# EAGLE design kultpfunzel (EAGLE 6.5.0)
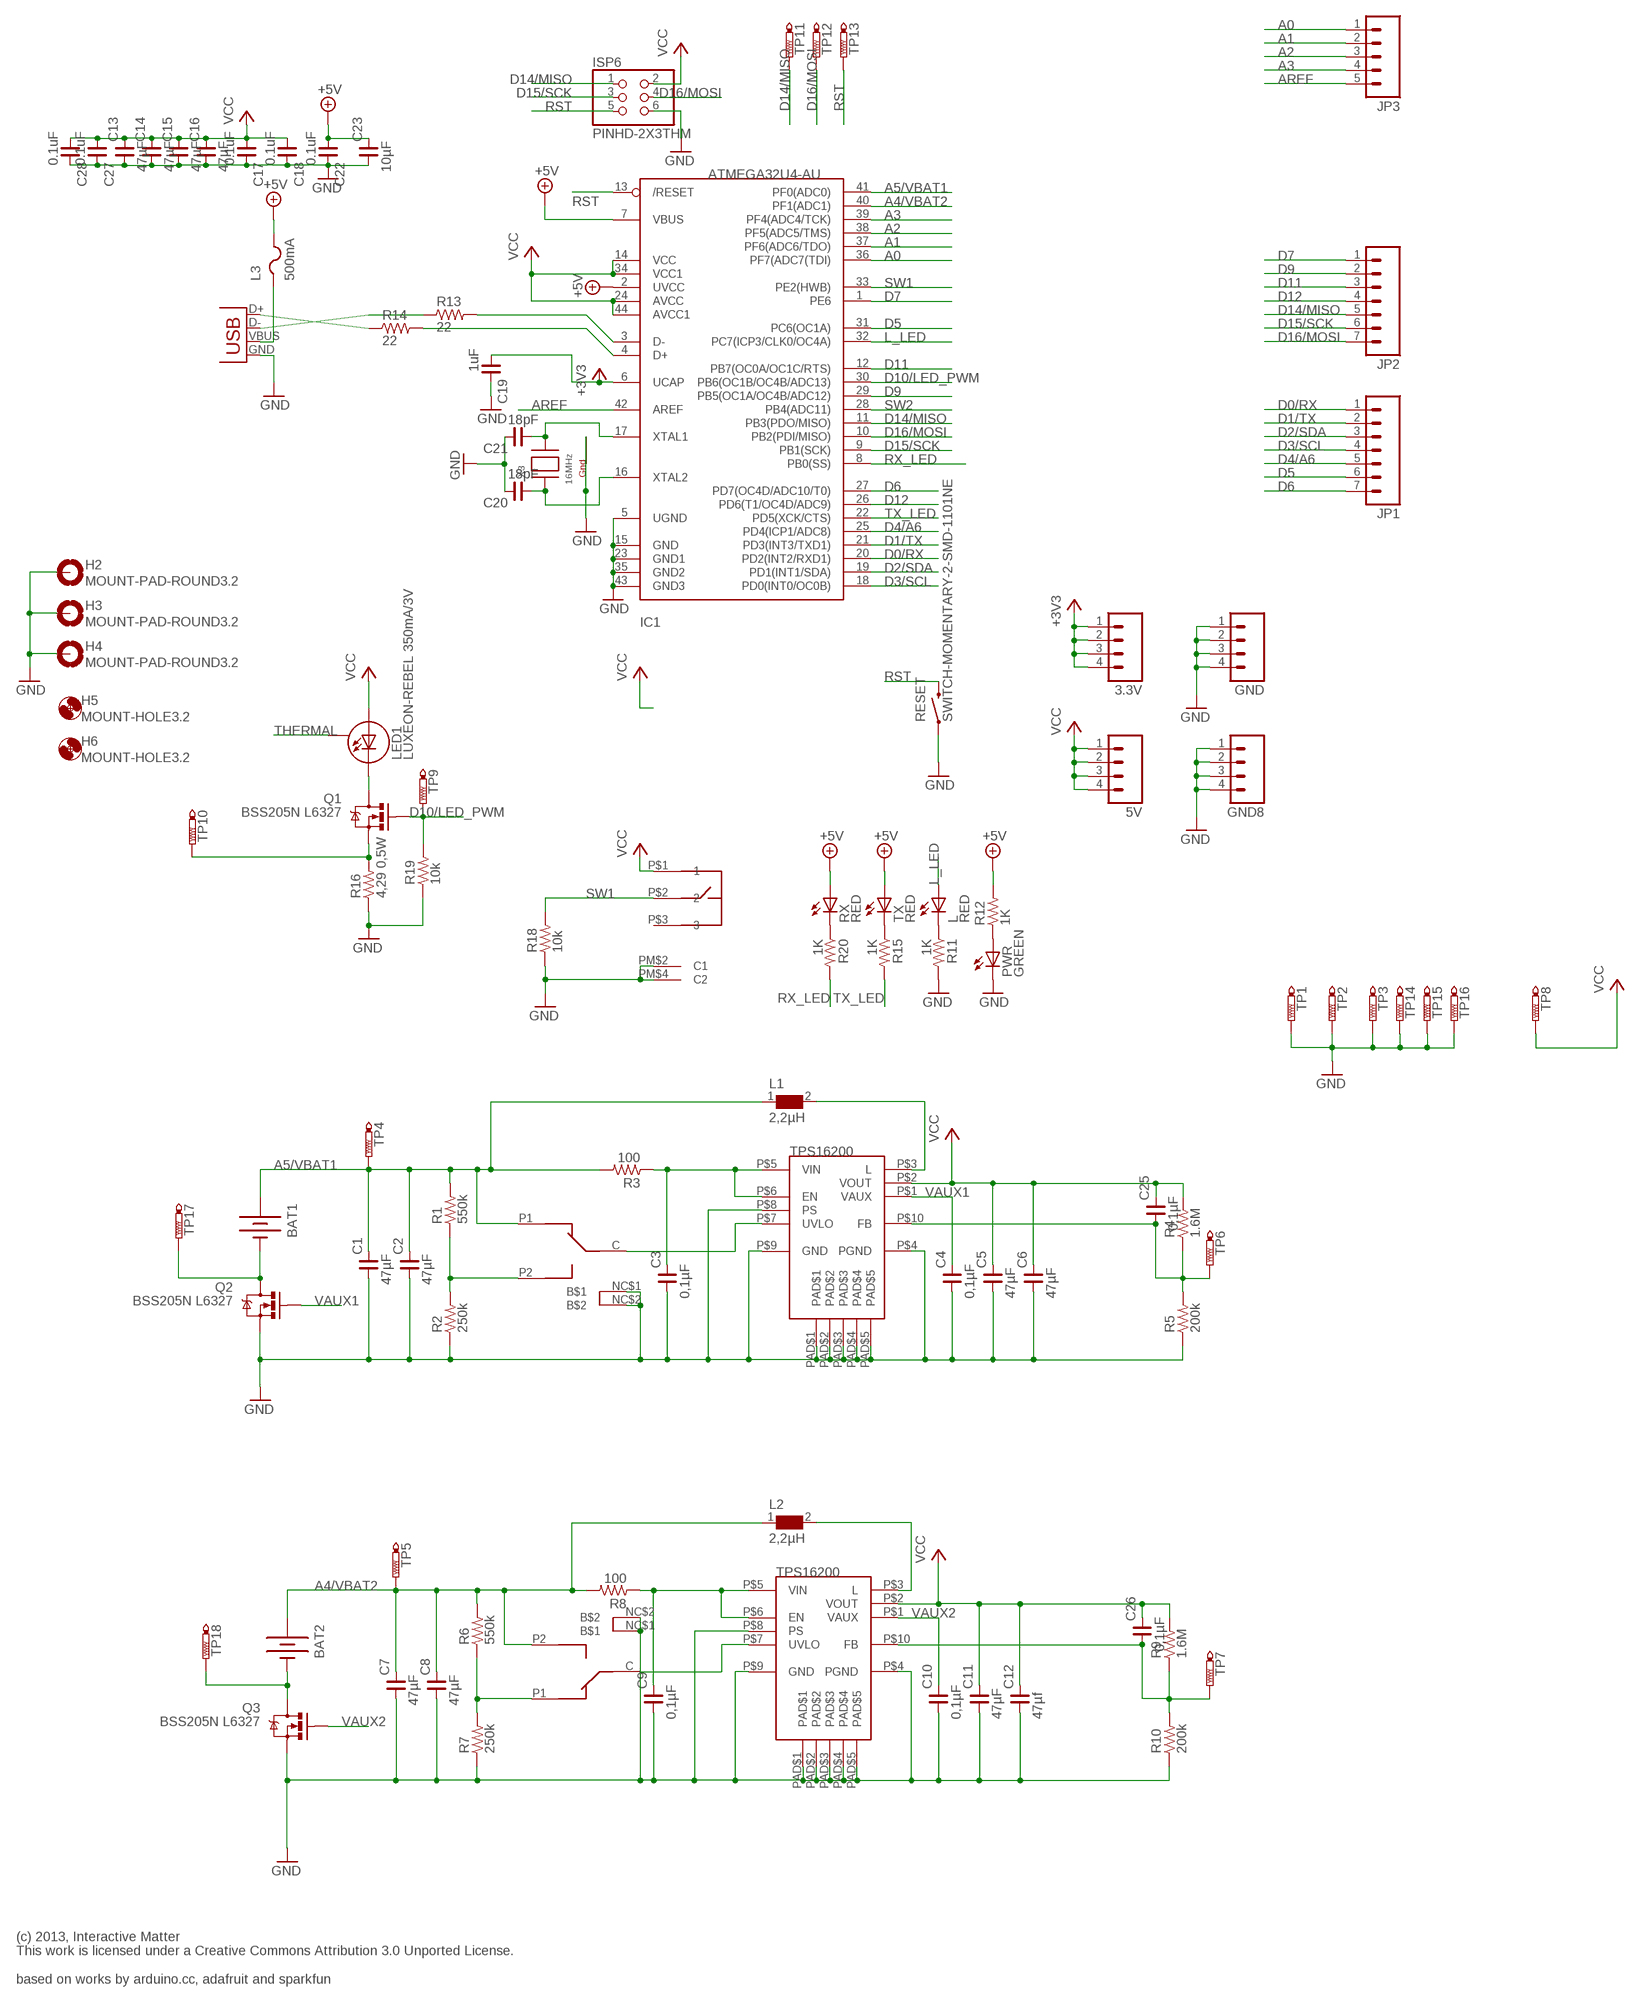
[diagram p0: schematic, sheet 1]

## Parts
3.3V  M04PTH  [1X04]
5V  M04PTH  [1X04]
BAT1  BATTERYAA  [BATTERY-AA]
BAT2  BATTERYAA  [BATTERY-AA]
C1  47µF  C_1206  [C1206]
C2  47µF  C_1206  [C1206]
C3  0,1µF  C_0402  [C0402]
C4  0,1µF  C_0402  [C0402]
C5  47µF  C_0805  [C0805]
C6  47µF  C_0805  [C0805]
C7  47µF  C_1206  [C1206]
C8  47µF  C_1206  [C1206]
C9  0,1µF  C_0402  [C0402]
C10  0,1µF  C_0402  [C0402]
C11  47µF  C_0805  [C0805]
C12  47µf  C_0805  [C0805]
C13  47µF  C_1206  [C1206]
C14  47µF  C_1206  [C1206]
C15  47µF  C_1206  [C1206]
C16  47µF  C_1206  [C1206]
C17  0.1uF  C_0402  [C0402]
C18  0.1uF  C_0402  [C0402]
C19  1uF  C_0603  [C0603]
C20  18pF  C_0402  [C0402]
C21  18pF  C_0402  [C0402]
C22  0.1uF  C_0603  [C0603]
C23  10µF  C_1206  [C1206]
C25  0,1µF  C_0603  [C0603]
C26  0,1µF  C_0603  [C0603]
C27  0.1uF  C_0402  [C0402]
C28  0.1uF  C_0402  [C0402]
GND  M04PTH  [1X04]
GND8  M04PTH  [1X04]
H2  MOUNT-PAD-ROUND3.2  [3,2-PAD]
H3  MOUNT-PAD-ROUND3.2  [3,2-PAD]
H4  MOUNT-PAD-ROUND3.2  [3,2-PAD]
H5  MOUNT-HOLE3.2  [3,2]
H6  MOUNT-HOLE3.2  [3,2]
IC1  ATMEGA32U4-AU  [TQFP44]
IC2  TPS61200DRCT  TPS16200  [10SON]
IC3  TPS61200DRCT  TPS16200  [10SON]
ISP6  PINHD-2X3THM  [ISP6]
JP1  M07  [1X07]
JP2  M07  [1X07]
JP3  M05PTH  [1X05]
L  RED  LEDCHIPLED_0603  [CHIPLED_0603]
L1  2,2µH  WE-PD2_M/MS  [WE-PD2_M/MS]
L2  2,2µH  WE-PD2_M/MS  [WE-PD2_M/MS]
L3  500mA  PTCFUSE-1206  [R1206]
LED1  LUXEON-REBEL 350mA/3V  LUXEON-REBEL  [LUXEON-REBEL]
PWR  GREEN  LEDCHIPLED_0603  [CHIPLED_0603]
Q1  BSS205N L6327  MOSFET-NCHANNELSMD  [SOT23-3]
Q2  BSS205N L6327  MOSFET-NCHANNELSMD  [SOT23-3]
Q3  BSS205N L6327  MOSFET-NCHANNELSMD  [SOT23-3]
R1  550k  R_0603  [R0603]
R2  250k  R_0603  [R0603]
R3  100  R_0603  [R0603]
R4  1.6M  R_0603  [R0603]
R5  200k  R_0603  [R0603]
R6  550k  R_0603  [R0603]
R7  250k  R_0603  [R0603]
R8  100  R_0603  [R0603]
R9  1.6M  R_0603  [R0603]
R10  200k  R_0603  [R0603]
R11  1K  R_0603  [R0603]
R12  1K  R_0603  [R0603]
R13  22  R_0603  [R0603]
R14  22  R_0603  [R0603]
R15  1K  R_0603  [R0603]
R16  4,29 0,5W  R_1210  [R1210]
R18  10k  R_0603  [R0603]
R19  10k  R_0603  [R0603]
R20  1K  R_0603  [R0603]
RESET  SWITCH-MOMENTARY-2-SMD-1101NE  [TACTILE-SWITCH-1101NE]
RX  RED  LEDCHIPLED_0603  [CHIPLED_0603]
SW  TL4105AF  [TL4105AF]
SW1  SMDSWITCHAYZ0102  [SMDSWITCH]
SW2  SMDSWITCHAYZ0102  [SMDSWITCH]
TP1  PTR1B1,27  [B1,27]
TP2  PTR1B1,27  [B1,27]
TP3  PTR1B1,27  [B1,27]
TP4  PTR1B1,27  [B1,27]
TP5  PTR1B1,27  [B1,27]
TP6  PTR1B1,27  [B1,27]
TP7  PTR1B1,27  [B1,27]
TP8  PTR1B1,27  [B1,27]
TP9  PTR1B1,27  [B1,27]
TP10  PTR1B1,27  [B1,27]
TP11  PTR1B1,27  [B1,27]
TP12  PTR1B1,27  [B1,27]
TP13  PTR1B1,27  [B1,27]
TP14  PTR1B1,27  [B1,27]
TP15  PTR1B1,27  [B1,27]
TP16  PTR1B1,27  [B1,27]
TP17  PTR1B1,27  [B1,27]
TP18  PTR1B1,27  [B1,27]
TX  RED  LEDCHIPLED_0603  [CHIPLED_0603]
USB  USB  USBMINIB-VERT  [USB-MINIB-VERT]
X3  16MHz  XTAL-4-3225  [NX3225]

## Nets
+3V3: 3.3V.1 3.3V.2 3.3V.3 3.3V.4 C19.1 IC1.6(UCAP)
+5V: C22.1 C23.2 IC1.2(UVCC) IC1.7(VBUS) L3.2 R12.2 RX.A TX.A
A0: IC1.36(PF7(ADC7(TDI)) JP3.1
A1: IC1.37(PF6(ADC6/TDO)) JP3.2
A2: IC1.38(PF5(ADC5/TMS)) JP3.3
A3: IC1.39(PF4(ADC4/TCK)) JP3.4
A4/VBAT2: BAT2.PWR@1(+) C7.2 C8.2 IC1.40(PF1(ADC1)) L2.1 R6.2 R8.2 SW1.P2 TP5.TP
A5/VBAT1: BAT1.PWR@1(+) C1.2 C2.2 IC1.41(PF0(ADC0)) L1.1 R1.2 R3.2 SW2.P1 TP4.TP
AREF: IC1.42(AREF) JP3.5
D0/RX: IC1.20(PD2(INT2/RXD1)) JP1.1
D1/TX: IC1.21(PD3(INT3/TXD1)) JP1.2
D2/SDA: IC1.19(PD1(INT1/SDA)) JP1.3
D3/SCL: IC1.18(PD0(INT0/OC0B)) JP1.4
D4/A6: IC1.25(PD4(ICP1/ADC8)) JP1.5
D5: IC1.31(PC6(OC1A)) JP1.6
D6: IC1.27(PD7(OC4D/ADC10/T0)) JP1.7
D7: IC1.1(PE6) JP2.1
D9: IC1.29(PB5(OC1A/OC4B/ADC12)) JP2.2
D10/LED_PWM: IC1.30(PB6(OC1B/OC4B/ADC13)) Q1.1(G) R19.2 TP9.TP
D11: IC1.12(PB7(OC0A/OC1C/RTS)) JP2.3
D12: IC1.26(PD6(T1/OC4D/ADC9)) JP2.4
D14/MISO: IC1.11(PB3(PDO/MISO)) ISP6.1 JP2.5 TP11.TP
D15/SCK: IC1.9(PB1(SCK)) ISP6.3 JP2.6
D16/MOSI: IC1.10(PB2(PDI/MISO)) ISP6.4 JP2.7 TP12.TP
GND: C1.1 C2.1 C3.1 C4.1 C5.1 C6.1 C7.1 C8.1 C9.1 C10.1 C11.1 C12.1 C13.1 C14.1 C15.1 C16.1 C17.2 C18.2 C19.2 C20.2 C21.2 C22.2 C23.1 C27.2 C28.2 GND8.1 GND8.2 GND8.3 GND8.4 GND.1 GND.2 GND.3 GND.4 H2.B3,2(MOUNT) H3.B3,2(MOUNT) H4.B3,2(MOUNT) IC1.5(UGND) IC1.15(GND) IC1.23(GND1) IC1.35(GND2) IC1.43(GND3) IC2.P$4(PGND) IC2.P$8(PS) IC2.P$9(GND) IC2.PAD$1 IC2.PAD$2 IC2.PAD$3 IC2.PAD$4 IC2.PAD$5 IC3.P$4(PGND) IC3.P$8(PS) IC3.P$9(GND) IC3.PAD$1 IC3.PAD$2 IC3.PAD$3 IC3.PAD$4 IC3.PAD$5 ISP6.6 PWR.C Q2.2(S) Q3.2(S) R2.1 R5.1 R7.1 R10.1 R11.2 R16.1 R18.1 R19.1 RESET.P$1 SW1.NC$1(B$1) SW1.NC$2(B$2) SW2.NC$1(B$1) SW2.NC$2(B$2) SW.PM$2(C1) SW.PM$4(C2) TP1.TP TP2.TP TP3.TP TP14.TP TP15.TP TP16.TP USB.GND X3.2(G2) X3.4(G1)
L_LED: IC1.32(PC7(ICP3/CLK0/OC4A)) L.A
N$1: PWR.A R12.1
N$2: R14.1 USB.D+
N$3: IC1.3(D-) R13.2
N$4: IC1.4(D+) R14.2
N$5: R13.1 USB.D-
N$6: LED1.CATHODE(C) Q1.3(D)
N$7: IC2.P$3(L) L1.2
N$8: C21.1 IC1.17(XTAL1) X3.3(X2)
N$9: C20.1 IC1.16(XTAL2) X3.1(X1)
N$10: L.C R11.1
N$11: R1.1 R2.2 SW2.P2
N$12: IC2.P$7(UVLO) SW2.C
N$13: Q1.2(S) R16.2 TP10.TP
N$14: C25.1 IC2.P$10(FB) R4.1 R5.2 TP6.TP
N$15: BAT1.GND@1(-) Q2.3(D) TP17.TP
N$17: BAT2.GND@1(-) Q3.3(D) TP18.TP
N$18: R15.1 TX.C
N$19: R20.1 RX.C
N$23: R6.1 R7.2 SW1.P1
N$24: IC3.P$7(UVLO) SW1.C
N$25: IC3.P$3(L) L2.2
N$26: C26.1 IC3.P$10(FB) R9.1 R10.2 TP7.TP
RST: IC1.13(/RESET) ISP6.5 RESET.P$2 TP13.TP
RX_LED: IC1.8(PB0(SS)) R20.2
SW1: IC1.33(PE2(HWB)) R18.2 SW.P$2
SW2: IC1.28(PB4(ADC11))
THERMAL: LED1.P$3(S)
TX_LED: IC1.22(PD5(XCK/CTS)) R15.2
VAUX1: C4.2 IC2.P$1(VAUX) Q2.1(G)
VAUX2: C10.2 IC3.P$1(VAUX) Q3.1(G)
VBUS: L3.1 USB.VBUS
VCC: 5V.1 5V.2 5V.3 5V.4 C5.2 C6.2 C11.2 C12.2 C13.2 C14.2 C15.2 C16.2 C17.1 C18.1 C25.2 C26.2 C27.1 C28.1 IC1.14(VCC) IC1.24(AVCC) IC1.34(VCC1) IC1.44(AVCC1) IC2.P$2(VOUT) IC3.P$2(VOUT) ISP6.2 LED1.ANODE(A) R4.2 R9.2 SW.P$1 TP8.TP
VI1: C3.2 IC2.P$5(VIN) IC2.P$6(EN) R3.1
VI2: C9.2 IC3.P$5(VIN) IC3.P$6(EN) R8.1
Unconnected: SW.P$3

## Notes on the sheet
- (c) 2013, Interactive Matter
  This work is licensed under a Creative Commons Attribution 3.0 Unported License.
  
  based on works by arduino.cc, adafruit and sparkfun

## Library data of the parts
3.3V 5V GND GND8 = SparkFun:M04: Header 4 Standard 4-pin 0.1" header. Use with straight break away headers (SKU : PRT-00116), right angle break away headers (PRT-00553), swiss pins (PRT-00743), machine pins (PRT-00117), and female headers (PRT-00115). Molex polarized connector foot print use with SKU : PRT-08231 with associated crimp pins and housings.
BAT1 BAT2 = SparkFun:BATTERY: Battery Holders Various common sizes : AA, AAA, 20mm coin cell and 12mm coin cell.
C1-C23 C25-C28 = rc-master-smd:C_: NON-POLARIZED CAP
H2-H4 = holes:MOUNT-PAD-ROUND: MOUNTING PAD, round
H5 H6 = holes:MOUNT-HOLE: MOUNTING HOLE with drill center marker
IC1 = adaprog:ATMEGA32U4
IC2 IC3 = additional:TPS16200
ISP6 = adaprog:PINHD-2X3
JP1 JP2 = SparkFun:M07: Header 7 Standard 7-pin 0.1" header. Use with straight break away headers (SKU : PRT-00116), right angle break away headers (PRT-00553), swiss pins (PRT-00743), machine pins (PRT-00117), and female headers (PRT-00115). NOTES ON THE VARIANTS LOCK and LOCK_LONGPADS... This footprint was designed to help hold the alignment of a through-hole component (i.e. 7-pin header) while soldering it into place. You may notice that each hole has been shifted either up or down by 0.005 of an inch from it's more standard position (which is usually a perfectly straight line). This slight alteration caused the pins (the squares in the middle) to touch the edges of the holes. Because they are alternating, it causes a "brace" to hold the header in place. 0.005 has proven to be the perfect amount of "off-center" position when using our standard breakaway headers. Although looks a little odd when you look at the bare footprint, once you have a header in there, the alteration is very hard to notice. Also, if you push a header all the way into place, it is covered up entirely on the bottom side. This idea of altering the position of holes to aid alignment will be further integrated into the Sparkfun Library for other footprints. It can help hold any component with 3 or more connection pins.
JP3 = SparkFun:M05: Header 5 Standard 5-pin 0.1" header. Use with straight break away headers (SKU : PRT-00116), right angle break away headers (PRT-00553), swiss pins (PRT-00743), machine pins (PRT-00117), and female headers (PRT-00115). Molex polarized connector foot print use with SKU : PRT-08230 with associated crimp pins and housings.
L PWR RX TX = adafruit:LED: LED OSRAM: - CHIPLED LG R971, LG N971, LY N971, LG Q971, LY Q971, LO R971, LY R971 LH N974, LH R974 LS Q976, LO Q976, LY Q976 LO Q996 - Hyper CHIPLED LW Q18S LB Q993, LB Q99A, LB R99A - SideLED LS A670, LO A670, LY A670, LG A670, LP A670 LB A673, LV A673, LT A673, LW A673 LH A674 LY A675 LS A676, LA A676, LO A676, LY A676, LW A676 LS A679, LY A679, LG A679 - Hyper Micro SIDELED® LS Y876, LA Y876, LO Y876, LY Y876 LT Y87S - SmartLED LW L88C, LW L88S LB L89C, LB L89S, LG L890 LS L89K, LO L89K, LY L89K LS L896, LA L896, LO L896, LY L896 - TOPLED LS T670, LO T670, LY T670, LG T670, LP T670 LSG T670, LSP T670, LSY T670, LOP T670, LYG T670 LG T671, LOG T671, LSG T671 LB T673, LV T673, LT T673, LW T673 LH T674 LS T676, LA T676, LO T676, LY T676, LB T676, LH T676, LSB T676, LW T676 LB T67C, LV T67C, LT T67C, LS T67K, LO T67K, LY T67K, LW E67C LS E67B, LA E67B, LO E67B, LY E67B, LB E67C, LV E67C, LT E67C LW T67C LS T679, LY T679, LG T679 LS T770, LO T770, LY T770, LG T770, LP T770 LB T773, LV T773, LT T773, LW T773 LH T774 LS E675, LA E675, LY E675, LS T675 LS T776, LA T776, LO T776, LY T776, LB T776 LHGB T686 LT T68C, LB T68C - Hyper Mini TOPLED® LB M676 - Mini TOPLED Santana® LG M470 LS M47K, LO M47K, LY M47K Source: http://www.osram.convergy.de/
L1 L2 = wuerth_elektronik_eisos__v6.1:WE-PD2: SMD-Power Inductors WE-PD2 - Industry standard size - Current capability up to 14 A -- Switching regulators with low operating voltages (computer, laptop, mobile phones, pagers) -- Integrated DC/DC-converter -- Is recommended for the application with switching regulators from National Semiconductor, Linear Technology, Texas Instruments and Fairchild Semiconductor -- Perfectly suitable for switching regulators with extremely high efficiency
L3 = adafruit:PTCFUSE: PTC fuses, resettable thermistors
LED1 = SparkFun:LUXEON-REBEL
Q1-Q3 = SparkFun:MOSFET-NCHANNEL
R1-R16 R18-R20 = rc-master-smd:R_: RESISTOR
RESET = SparkFun:SWITCH-MOMENTARY-2
SW = additional:TL4105AF
SW1 SW2 = additional:SMDSWITCH: C&K Components AYZ0102AGRLC
TP1-TP18 = testpad:PTR1: TEST PIN
USB = additional:USB: USB Connectors USB-B-PTH is fully proven SKU : PRT-00139 USB-miniB is fully proven SKU : PRT-00587 USB-A-PCB is untested. USB-A-H is throughly reviewed, but untested. Spark Fun Electronics SKU : PRT-00437 USB-B-SMT is throughly reviewed, but untested. Needs silkscreen touching up. USB-A-S has not been used/tested USB-MB-H has not been used/tested
X3 = adafruit:XTAL-4: Classic 4-pin 3.2 x 2.5mm crystal

## Net classes
0 default: width 0.152 mm, drill 0.25 mm, clearance 0.152 mm

## Board
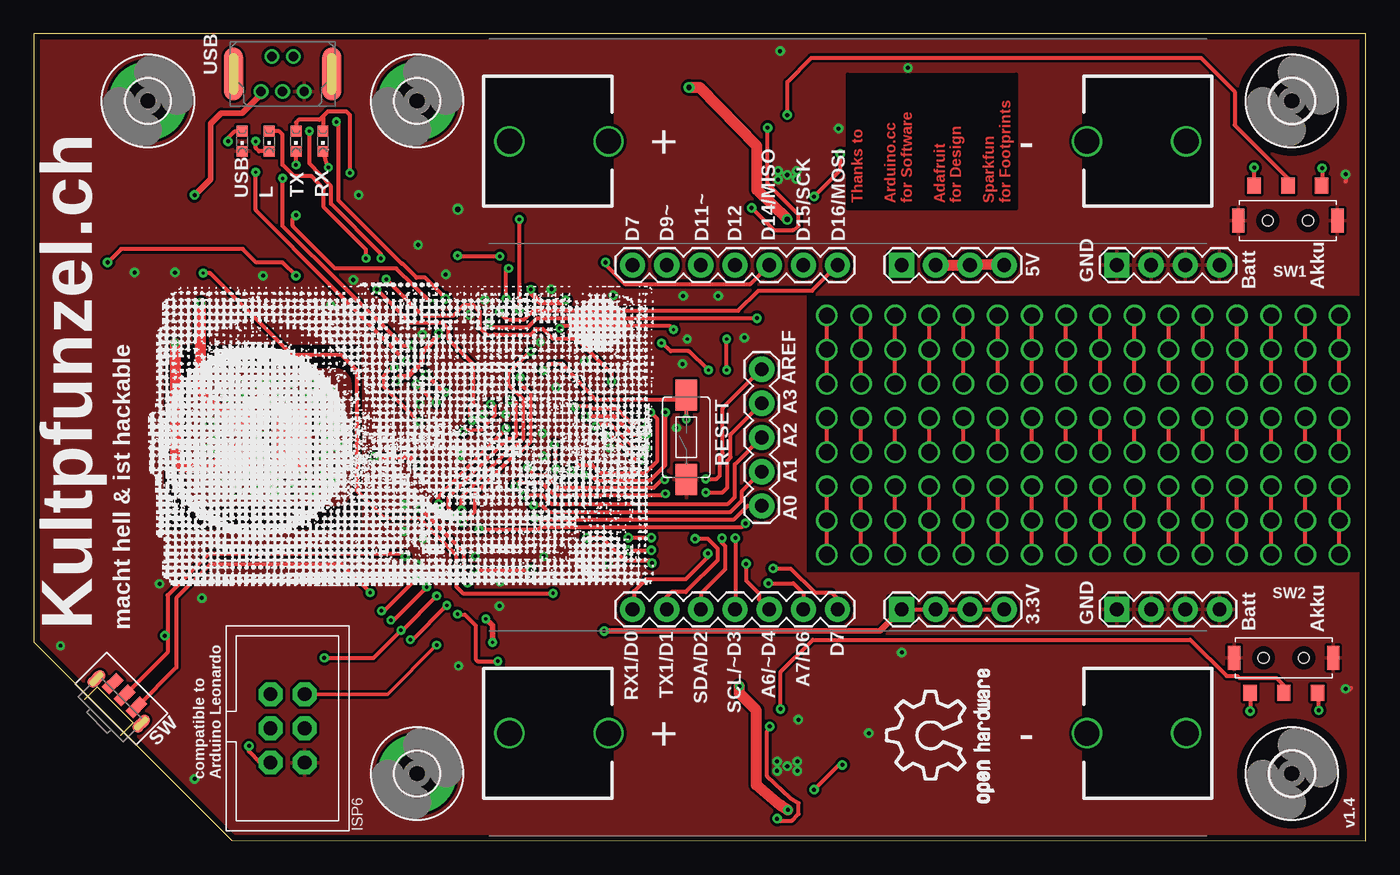
[diagram p1: board, top side]
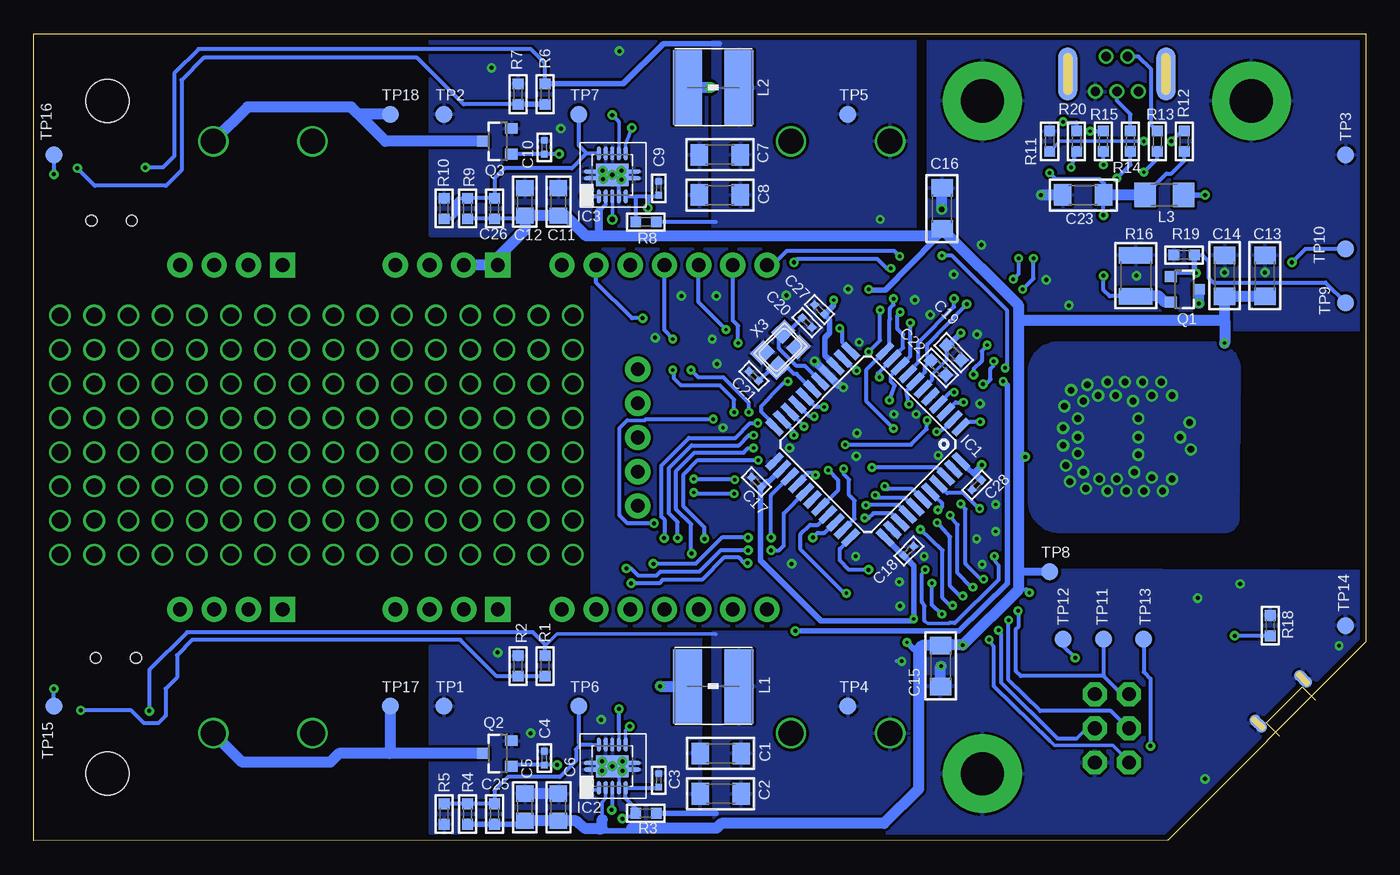
[diagram p2: board, bottom side, seen from below]

Size 99 x 60 mm. Coordinates in mm from the lower left corner, seen from the top.
Outline: 14.7,0.05 99,0 99,60 0,60 0,14.8 14.7,0.05
Copper layers (1*16): Top 0.035mm / dielectric 1.55mm / Bottom 0.035mm
Design rules "eC-STANDARD_pool-2-layer-35Ê-base-copper": minimum track width 0.15mm, minimum drill 0.25mm, track to track 0.2mm, track to pad 0.2mm, pad to pad 0.2mm, via to via 0.2mm, smd to smd 0.2mm, copper to edge 0.45mm, drill to drill 0.3mm, minimum pad ring 0.2mm, minimum via ring 0.2mm, stop-mask expansion 0.1mm, vias tented up to drill 0mil, thermal gap 0.2mm
tRestrict: 8 lines

### Footprints (pad centres in the part's own frame; a part is rotated, then mirrored left to right if it is on the bottom)
1X04 = drill 1.016 pad 1.88 square: 1 0,0 | drill 1.016 pad 1.88: 2 2.54,0; 3 5.08,0; 4 7.62,0
BATTERY-AA = drill 1.854: GND@1 25.146,0; GND@2 17.78,0; PWR@1 -25.146,0; PWR@2 -17.78,0
C1206 = smd 1.3 x 1.6: 1 -1.524,0; 2 1.524,0
C0402 = smd 0.5 x 0.5: 1 -0.508,0; 2 0.508,0
C0805 = smd 1.2 x 1.3: 1 -1.016,0; 2 1.016,0
C0603 = smd 0.8 x 0.8: 1 -0.762,0; 2 0.762,0
3,2-PAD = drill 3.2 pad 5.842: B3,2 0,0
3,2 = hole 3.2: 0,0
TQFP44 = smd 1.5 x 0.5: 1 -5.8,4; 2 -5.8,3.2; 3 -5.8,2.4; 4 -5.8,1.6; 5 -5.8,0.8; 6 -5.8,0; 7 -5.8,-0.8; 8 -5.8,-1.6; 9 -5.8,-2.4; 10 -5.8,-3.2; 11 -5.8,-4; 23 5.8,-4; 24 5.8,-3.2; 25 5.8,-2.4; 26 5.8,-1.6; 27 5.8,-0.8; 28 5.8,0; 29 5.8,0.8; 30 5.8,1.6; 31 5.8,2.4; 32 5.8,3.2; 33 5.8,4 | smd 0.5 x 1.5: 12 -4,-5.8; 13 -3.2,-5.8; 14 -2.4,-5.8; 15 -1.6,-5.8; 16 -0.8,-5.8; 17 0,-5.8; 18 0.8,-5.8; 19 1.6,-5.8; 20 2.4,-5.8; 21 3.2,-5.8; 22 4,-5.8; 34 4,5.8; 35 3.2,5.8; 36 2.4,5.8; 37 1.6,5.8; 38 0.8,5.8; 39 0,5.8; 40 -0.8,5.8; 41 -1.6,5.8; 42 -2.4,5.8; 43 -3.2,5.8; 44 -4,5.8
10SON = smd 0.28 x 1: P$1 -1,-1.6; P$2 -0.5,-1.6; P$3 0,-1.6; P$4 0.5,-1.6; P$5 1,-1.6; P$6 1,1.6; P$7 0.5,1.6; P$8 0,1.6; P$9 -0.5,1.6; P$10 -1,1.6 | smd 2.4 x 1.65: PAD$1 0,0 | smd 1 x 0.28: PAD$2 -1.6,0.25; PAD$3 -1.6,-0.25; PAD$4 1.6,0.25; PAD$5 1.6,-0.25
ISP6 = drill 1.016 pad 1.778 octagon: 1 -2.54,-1.27; 2 -2.54,1.27; 3 0,-1.27; 4 0,1.27; 5 2.54,-1.27; 6 2.54,1.27
1X07 = drill 1.016 pad 1.88: 1 0,0; 2 2.54,0; 3 5.08,0; 4 7.62,0; 5 10.16,0; 6 12.7,0; 7 15.24,0
1X05 = drill 1.016 pad 1.88: 1 0,0; 2 2.54,0; 3 5.08,0; 4 7.62,0; 5 10.16,0
CHIPLED_0603 = smd 0.8 x 0.8: A 0,-0.75; C 0,0.75
WE-PD2_M/MS = smd 2.15 x 5.5: 1 -1.925,0; 2 1.925,0
R1206 = smd 1.6 x 1.803: 1 -1.422,0; 2 1.422,0
LUXEON-REBEL = smd 1.91 x 2.03: ANODE -1.39,2.63; CATHODE 1.39,2.63 | smd 4.68 x 3.03: P$3 0,-1.42
SOT23-3 = smd 0.8 x 0.9: 1 -0.95,-1; 2 0.95,-1; 3 0,1.1
R0603 = smd 0.8 x 0.8: 1 -0.762,0; 2 0.762,0
R1210 = smd 1.2 x 2.5: 1 -1.524,0; 2 1.524,0
TACTILE-SWITCH-1101NE = smd 2.3 x 1.6: P$1 -3.15,0; P$2 3.15,0
TL4105AF = smd 0.8 x 1.5: P$1 -1.25,-1; P$2 0,-1; P$3 1.25,-1; PM$1 -2.35,-0.4; PM$3 2.35,-0.4 | smd 0.8 x 1.5 bottom: PM$2 -2.35,-0.4; PM$4 2.35,-0.4
SMDSWITCH = smd 1 x 1.2: C 0,2.6; P1 2.5,2.6; P2 -2.5,2.6 | smd 0.914 x 1.778: NC$1 -3.683,0; NC$2 3.683,0 | hole 0.8: -1.5,0; 1.5,0
B1,27 = smd 1.27 x 1.27: TP 0,0
USB-MINIB-VERT = drill 0.7: D+ 0,-1.3; D- -0.8,1.3; GND 1.6,-1.3; ID 0.8,1.3; VBUS -1.6,-1.3 | smd 1.4 x 3.9: P$1 -3.65,0; P$3 3.65,0 | smd 1.4 x 3.9 bottom: P$2 -3.65,0; P$4 3.65,0
NX3225 = smd 1.4 x 1.2: 1 -1.1,-0.8; 2 1.1,-0.8; 3 1.1,0.8; 4 -1.1,0.8

### Placement (x,y rotation side)
3.3V  64.5,17.2 0 top
5V  64.5,42.8 0 top
BAT1  60.5,8 0 top
BAT2  60.5,52 0 top
C1  47.95,6.5 0 bottom
C2  47.95,3.5 0 bottom
C3  52.55,4.5 270 bottom
C4  61.05,6.15 270 bottom
C5  62.5,2.5 270 bottom
C6  60,2.5 270 bottom
C7  48,51 0 bottom
C8  48,48 0 bottom
C9  52.55,48.5 270 bottom
C10  61.05,51.55 270 bottom
C11  60,47.5 270 bottom
C12  62.5,47.5 270 bottom
C13  7.5,42 270 bottom
C14  10.5,42 270 bottom
C15  31.6,13 90 bottom
C16  31.5,47 270 bottom
C17  45.28,26.66 135 bottom
C18  33.97,21.54 45 bottom
C19  30.62,36.29 315 bottom
C20  41.52,38.53 315 bottom
C21  45.48,34.54 135 bottom
C22  31.76,35.17 315 bottom
C23  21,48 0 bottom
C25  64.75,2 270 bottom
C26  64.75,47 270 bottom
C27  40.6,39.5 135 bottom
C28  28.9,26.45 225 bottom
GND  80.5,17.2 0 top
GND8  80.5,42.8 0 top
H2  8.5,55 0 top
H3  28.5,5 0 top
H4  28.5,55 0 top
H5  93.5,5 0 top
H6  93.5,55 0 top
IC1  37.01,29.48 225 bottom
IC2  56,5.55 0 bottom
IC3  56,49.5 0 bottom
ISP6  18.87,8.36 270 top
JP1  44.5,17.2 0 top
JP2  44.5,42.8 0 top
JP3  54.1,24.9 90 top
L  17.5,52 180 top
L1  48.5,11.5 180 bottom
L2  48.5,56 180 bottom
L3  14.98,48.02 180 bottom
LED1  17.75,30 90 top
PWR  15.5,52 180 top
Q1  13.5,41 270 bottom
Q2  64.5,6.5 90 bottom
Q3  64.5,52 90 bottom
R1  61,13 90 bottom
R2  63,13 270 bottom
R3  53.5,2.05 0 bottom
R4  66.75,2 270 bottom
R5  68.5,2 90 bottom
R6  61,55.5 90 bottom
R7  63,55.5 270 bottom
R8  53.5,46 0 bottom
R9  66.75,47 270 bottom
R10  68.5,47 270 bottom
R11  23.5,52 90 bottom
R12  13.5,52 270 bottom
R13  15.5,52 270 bottom
R14  17.5,52 270 bottom
R15  19.5,52 90 bottom
R16  17.1,42 270 bottom
R18  7.1,16 270 bottom
R19  13.5,43.55 0 bottom
R20  21.5,52 90 bottom
RESET  48.5,30 90 top
RX  21.5,52 180 top
SW  6.05,10.1 135 top
SW1  93.2,46.1 0 top
SW2  92.9,13.6 180 top
TP1  68.5,10 0 bottom
TP2  68.5,54 0 bottom
TP3  1.5,51 0 bottom
TP4  38.5,10 0 bottom
TP5  38.5,54 0 bottom
TP6  58.5,10 0 bottom
TP7  58.5,54 0 bottom
TP8  23.5,20 0 bottom
TP9  1.5,40 0 bottom
TP10  1.5,44 0 bottom
TP11  19.5,15 0 bottom
TP12  22.5,15 0 bottom
TP13  16.5,15 0 bottom
TP14  1.5,16 0 bottom
TP15  97.5,10 0 bottom
TP16  97.5,51 0 bottom
TP17  72.5,10 0 bottom
TP18  72.5,54 0 bottom
TX  19.5,52 180 top
U$1  [LOGO]  47.5,16.95 90 top
U$2  [OSHW_LOGO_10MM]  71.4,2.8 90 top
USB  18.5,57 0 top
X3  43.5,36.5 225 bottom

### Tracks (layer width: path | path; a pad name or v marks a point on that pad's centre or on a via)
+3V3  (via drill 0.25, 0.3)
  Top 0.305: 3.3V.1 3.3V.2 3.3V.3 3.3V.4
  Top 0.406: v30.1,37.75 30.1,37.55 28.85,36.3 28.85,35.55 27.8,34.5 27.2,34.5 v26.95,34.15 | v42.4,15.6 62.9,15.6 3.3V.1
  Bottom 0.254: 31.16,35.74 32.25,34.65
  Bottom 0.305: IC1.6 32.91,33.59 32.25,34.25 32.25,34.65 | C19.1 31.16,35.74
  Bottom 0.406: v26.95,34.15 26.65,33.85 26.65,19.15 30.25,15.6 v42.4,15.6 | C19.1 31.02,36.83 v30.1,37.75
+5V  (via drill 0.25, 0.3)
  Top 0.254: 31.9,30.45 32.05,30.55 33.3,30.55 34.3,31.6 34.3,32.35 v33.95,32.45
  Top 0.305: v29.65,39.9 26.95,42.55 22.4,42.55 19.25,45.7 19.25,46.25 v19.5,46.5 | v31.9,30.4 31.9,30.45 | TX.A 19.5,53.4 19.7,53.6 21.25,53.6 21.5,53.85 | v23.5,49.65 23.5,53.95 23.25,54.2 21.85,54.2 21.5,53.85 | 21.5,53.85 RX.A
  Bottom 0.305: R12.2 13.5,50.55 14.45,49.6 14.82,49.6 L3.2 | v29.65,39.9 32.6,36.9 32.6,36 C22.1 32.75,35.26 32.75,34.85 33.45,34.15 IC1.7 34.15,33.47 v33.95,32.45 | v19.5,46.5 19.5,47.98 C23.2 | IC1.2 30.65,31.3 31.25,30.7 31.65,30.45 v31.9,30.4 | 19.46,48.02 19.46,48.86 19.8,49.2 23.05,49.2 v23.5,49.65
  Bottom 0.813: L3.2 19.46,48.02 C23.2
A0  (via drill 0.25)
  Top 0.305: JP3.1 53.05,24.9 52.05,23.9 37.35,23.9 v37.25,24
  Bottom 0.305: IC1.36 35.27,24.35 36.6,24.35 36.95,24 v37.25,24
A1  (via drill 0.25)
  Top 0.305: v37.15,24.95 37.75,24.95 38.25,24.45 51.8,24.45 52.65,25.3 52.65,25.99 JP3.2
  Bottom 0.305: IC1.37 34.74,24.95 v37.15,24.95
A2  (via drill 0.25)
  Top 0.305: v36.45,25.7 37.8,25.7 38.45,25.05 51.6,25.05 52.1,25.55 52.1,27.98 JP3.3
  Bottom 0.305: IC1.38 33.56,24.81 34.25,25.5 36.25,25.5 v36.45,25.7
A3  (via drill 0.25)
  Top 0.305: v46.95,25.8 46.85,25.7 38.7,25.7 37.75,26.65 36.05,26.65 v35.75,26.35 | JP3.4 51.8,30.22 51.8,28.5 51.55,28.25 51.55,26.25 51.2,25.9 v49.95,25.9
  Bottom 0.305: IC1.39 33.68,26.15 35.55,26.15 v35.75,26.35 | v46.95,25.8 49.85,25.8 v49.95,25.9
A4/VBAT2  (via drill 0.25, 0.3)
  Top 0.305: v31.8,24.6 31.8,25.55 35.6,29.35 35.85,29.35 36.4,29.9 36.4,32.8 35.3,33.9 35.3,34.8 36.95,36.45 v36.95,36.35 | v36.1,39.45 v36.1,46.2 | SW1.P2 v90.7,50.05
  Bottom 0.305: 48.3,46 R8.2 | R6.2 61,57.8 62.05,58.85 86.75,58.85 88.55,57.05 88.55,50.9 89.4,50.05 v90.7,50.05 | IC1.40 31.9,25.5 31.5,25.1 31.5,24.85 v31.8,24.6 | v36.95,36.35 36.1,37.2 v36.1,39.45
  Bottom 0.406: R6.2 55.19,56.26 52.2,59.25 48.05,59.25
  pour Bottom: 33.5,60 48.5,60 48.5,45 33.5,45
A5/VBAT1  (via drill 0.25, 0.3)
  Top 0.305: v28.7,24.7 32,21.45 32,19.3 v32.25,19.15 | v34.5,13.35 33,13.35 32.85,13.5 32.85,16 32.05,16.8 v31.5,16.85 | SW2.P1 v90.4,9.65
  Bottom 0.254: R1.2 61,14.5 60.1,15.4 48.35,15.4 48.3,15.35
  Bottom 0.305: R1.2 61,14.6 61.9,15.5 87.6,15.5 90.4,12.7 v90.4,9.65 | IC1.41 31.12,25.85 29.9,25.85 29,24.95 v28.7,24.7 | v34.5,13.35 34.85,13.35 | v32.25,19.15 32.25,17.55 v31.5,16.85
  Bottom 0.406: 48.3,2.05 R3.2
  pour Bottom: 33.5,15.5 48.5,15.5 48.45,0 37.6,0 33.55,4.05 33.55,4.15
AREF  (via drill 0.25)
  Top 0.305: JP3.5 51.2,32.16 51.2,28.8 51,28.6 51,27.15 50.75,26.9 v49.95,26.9 | v46.9,26.85 46.7,26.85 46.1,26.25 39,26.25 38.05,27.2 37.1,27.2 v36.7,27.75
  Bottom 0.305: IC1.42 31.89,27.75 v36.7,27.75 | v46.9,26.85 49.9,26.85 v49.95,26.9
D0/RX  (via drill 0.25, 0.3)
  Top 0.305: v41.75,30.8 41.9,30.95 42.9,30.95 44.65,29.2 v45.5,29.2 | v50.1,21.35 50.1,21.1 48.45,19.45 45.5,19.45 44.6,18.55 44.6,17.3 JP1.1
  Bottom 0.305: IC1.20 41.75,30.83 v41.75,30.8 | v45.5,29.2 45.9,29.2 46.25,28.85 49.9,28.85 51.25,27.5 51.25,24.65 50.15,23.55 50.15,21.4 v50.1,21.35
D1/TX  (via drill 0.25, 0.3)
  Top 0.305: v42.5,30.15 42.9,30.15 44.75,28.3 v45.15,28.3 | v49.15,22.45 50.1,22.45 50.85,21.7 50.85,20.9 48.45,18.5 47.4,18.5 47,18.1 47,17.24 JP1.2
  Bottom 0.305: IC1.21 42.5,30.44 v42.5,30.15 | v45.15,28.3 49.65,28.3 50.7,27.25 50.7,24.85 49.15,23.3 v49.15,22.45
D2/SDA  (via drill 0.25, 0.3)
  Top 0.305: v41,31.55 43.15,31.55 44.55,30.15 v45.5,30.15 | v51.15,22.5 51.15,22.15 51.4,21.9 51.4,20.2 49.6,18.4 49.6,17.22 JP1.3
  Bottom 0.305: IC1.19 41.34,31.55 v41,31.55 | v45.5,30.15 45.85,30.15 46.6,29.4 50.1,29.4 51.8,27.7 51.8,24.35 51.15,23.7 v51.15,22.5
D3/SCL  (via drill 0.25, 0.3)
  Top 0.305: v40.25,32.25 40.3,32.3 41.4,32.3 41.6,32.1 43.35,32.1 44.4,31.05 v45.2,31.05 | v52.15,22.5 52.15,17.23 JP1.4
  Bottom 0.305: IC1.18 40.91,32.25 v40.25,32.25 | v45.2,31.05 45.75,31.05 46.85,29.95 50.3,29.95 52.35,27.9 52.35,24.1 52.1,23.85 52.1,22.55 v52.15,22.5
D4/A6  (via drill 0.3)
  Top 0.305: v44.2,22.55 v45.9,22.55 | v52.95,20.6 52.95,19.35 53.9,18.4 53.9,17.96 JP1.5
  Bottom 0.305: IC1.25 42.82,27.08 44.2,25.7 v44.2,22.55 | v45.9,22.55 47.85,22.55 49.8,20.6 v52.95,20.6
D5  (via drill 0.3)
  Top 0.305: v41.1,22.55 42.2,22.55 43.9,20.85 45.75,20.85 v45.95,20.65 | v54.6,19.15 56.45,19.15 57.2,18.4 JP1.6
  Bottom 0.305: IC1.31 39.47,23.68 40.25,22.9 40.75,22.9 v41.1,22.55 | v45.95,20.65 46.2,20.65 46.6,21.05 47.7,21.05 49.35,19.4 52.25,19.4 52.5,19.15 v54.6,19.15
D6  (via drill 0.3)
  Top 0.305: v44.2,21.6 v45.9,21.6 | v54.95,20.25 56.25,20.25 58.05,18.45 59.3,18.45 59.8,17.95 59.8,17.26 JP1.7
  Bottom 0.305: IC1.27 41.68,25.92 43.25,24.35 43.25,21.95 43.6,21.6 v44.2,21.6 | v45.9,21.6 47.95,21.6 49.55,20 52.45,20 52.75,19.7 54.05,19.7 54.6,20.25 v54.95,20.25
D7  (via drill 0.25)
  Top 0.305: v28.65,31.15 26.05,33.75 26.05,34.6 26.6,35.15 v26.8,35.15 | v31.5,43.5 31.55,43.45 v34.65,43.45
  Bottom 0.305: IC1.1 29.68,31.15 v28.65,31.15 | v26.8,35.15 26.65,35.35 26.65,39.4 30.75,43.5 v31.5,43.5 | v34.65,43.45 35.05,43.85 43.05,43.85 44.1,42.8 JP2.1
D9  (via drill 0.25)
  Top 0.305: v46.65,37 47.35,36.4 48.7,36.4 v50.15,35 | v39.95,27.55 40.1,27.55 40.5,27.95 41.5,27.95 42.1,27.35 45.45,27.35 46.35,28.25 46.35,31.35 v45.85,31.85
  Bottom 0.305: JP2.2 47.04,38.69 46.65,38.3 v46.65,37 | v45.85,31.85 45.85,32.55 47.75,34.45 49.6,34.45 v50.15,35 | IC1.29 40.49,24.81 39.2,26.1 39.2,26.8 v39.95,27.55
D10/LED_PWM  (via drill 0.25)
  Top 0.305: v38.6,18.4 31.9,18.4 31.4,18.9 31.4,21.25 28.65,24 26.05,24 24.05,26 24.05,34.95 22.9,36.1 19.2,36.1 13.1,42.2 v12.6,42.2
  Bottom 0.305: v38.6,18.4 38.7,18.35 42,21.65 42,22.8 41.3,23.5 40.73,23.5 IC1.30 | Q1.1 14.25,42.2 v12.6,42.2 | R19.2 12.15,43.55 11.7,43.1 11.7,41.85 11.35,41.5 3,41.5 TP9.TP
  Bottom 0.406: R19.2 12.74,42.34 v12.6,42.2
D11  (via drill 0.25)
  Top 0.305: v39.1,38.1 39.3,38.3 47.25,38.3 v47.55,38
  Bottom 0.305: IC1.12 38.28,36.43 38.9,37.05 38.9,38 v39.1,38.1 | JP2.3 49.58,40.03 v47.55,38
D12  (via drill 0.25)
  Top 0.305: v51.5,35 v51.5,37.3 | v40.9,27.2 41.4,27.2 41.8,26.8 45.8,26.8 46.95,27.95 v46.95,31.85
  Bottom 0.305: JP2.4 52.12,37.97 v51.5,37.3 | v46.95,31.85 46.95,32.8 48,33.85 50.9,33.85 51.4,34.35 51.4,34.95 v51.5,35 | IC1.26 42.24,26.61 41.5,27.35 41.05,27.35 v40.9,27.2
D14/MISO  (via drill 0.25, 0.3)
  Top 0.305: v25.85,17.1 26.05,17.1 v28.4,19.45 | v30.1,25.05 30.1,25.6 34.65,30.15 v35.1,30.65 | v42.5,43 42.5,42.85 43.95,41.4 53.26,41.4 JP2.5 | v35.3,42.55 35.1,42.35 v35.1,40.3
  Bottom 0.305: ISP6.1 18.15,10.9 19.5,12.25 | 19.5,12.25 25.65,12.25 26,12.6 26,15.75 25.8,15.95 25.8,17.05 v25.85,17.1 | v28.4,19.45 28.6,19.45 29.75,20.6 29.75,24.65 v30.1,25.05 | v35.1,40.3 35.1,39.85 35.35,39.6 35.35,38.8 35.4,38.7 35.4,36.75 IC1.11 37.1,35.05 37.1,32.65 v35.1,30.65 | v42.5,43 42.25,43.25 36.3,43.25 35.6,42.55 v35.3,42.55 | TP11.TP 19.5,12.25
D15/SCK  (via drill 0.25, 0.3 pad 0.3)
  Top 0.305: v26.55,16.4 26.75,16.4 v29.2,18.85 | v30.9,24.2 30.9,24.65 30.85,24.8 30.85,25.55 35.2,29.9 35.65,29.9 35.85,30.1 35.85,32.55 35.6,32.75 v35.4,32.75 | v33.85,38.5 34.1,38.2 36.75,38.2 37.4,38.85 v53.75,38.85
  Bottom 0.305: ISP6.3 17.66,8.36 18.95,9.65 24.2,9.65 26.55,11.95 v26.55,16.4 | v29.2,18.85 29.3,18.85 30.35,19.9 30.35,23.5 v30.9,24.2 | v35.4,32.75 35,33.85 35.3,34.15 35.3,34.58 IC1.9 33.85,36.03 v33.85,38.5 | v53.75,38.85 54.55,38.85 57.2,41.5 JP2.6
D16/MOSI  (via drill 0.25, 0.3)
  Top 0.305: v29.95,18.2 27.4,15.65 v27.3,15.65 25.25,13.6 v21.6,13.6 | v31.85,23.65 31.9,23.65 31.95,23.7 32.25,23.95 32.8,24.5 32.8,25.8 35.8,28.8 36.05,28.8 36.95,29.7 36.95,33.2 36.15,34 v36.15,34.45 | v34.6,39.3 35.15,38.75 36.45,38.75 37.1,39.4 52.35,39.4 53.85,40.9 57.84,40.9 JP2.7
  Bottom 0.254: ISP6.4 20.74,8.36 21.5,7.6
  Bottom 0.305: 21.5,7.6 22.9,7.6 27.1,11.75 27.1,15.35 v27.3,15.65 | v29.95,18.2 30.15,18.2 30.9,18.95 30.9,22.6 v31.85,23.65 | v36.15,34.45 36.27,34.75 IC1.10 35.17,35.88 34.4,36.65 34.4,37.65 34.8,38.05 34.8,39.1 v34.6,39.3 | TP12.TP 22.5,14.5 v21.6,13.6
GND  (via drill 0.25, 0.3, 0.4)
  Top 0.305: v97.5,11.3 97.85,11.3 97.9,11.35 | v97.5,49.55 97.5,49
  Bottom 0.254: IC3.PAD$2 56.77,49.75 v56.72,49.8 | IC2.P$4 55.5,4.95 v55.25,5.2
  Bottom 0.305: IC3.P$4 55.5,48.97 v55.32,49.15 | TP15.TP v97.5,11.3 | TP16.TP v97.5,49.55
  Bottom 0.61: 39.05,33.85 39.15,33.85 40.7,35.4
  Bottom 0.813: C6.1 C5.1 | 31.4,48.5 C16.1 31.5,46.97 v31.52,46.95 | C23.1 v24.15,48 | C15.1 31.6,12.97 v31.57,13
  other vias: 56,5.55 56.75,5.2 56,49.5 55.32,49.8 56.67,49.2 55.47,58.7 2,14.5 55.25,5.9 56.75,5.9 7.5,42.25 32.82,21.15 31.77,28.65 33.42,31.7 38.82,33.7 42.82,29.2 37.92,21.15 33.52,40.2 38.47,41 48.57,37.3 52.82,37.4 48.22,35.45 43.07,40.55 48.27,40.5 50.87,40.5 42.67,20.6 28.67,32.5 37.87,28.6 27.52,23 23.75,41.7 28.9,37.65 17.05,42 10.5,42.25 27.52,25 28.52,20.55 34.67,19.25 34.62,17.45 47.77,30.7 62.07,8 59.82,52.95 9.35,19.1 12.5,18.05 35.07,31.7 37.82,30.3 32.37,39.1 30.62,42.1 28.57,44.3 22.07,39.8 37.65,37.05 40.97,35.65 28.92,22.45 64.97,57.45 64.52,14 56.82,9 11.95,4.6
  pour Top: 24.5,23 -2.5,23 -2.4,-1 99.5,-1 99.5,61.1 -2.5,61.1 -2.5,37 24.5,37
  pour Bottom: 49,60 69.5,60 69.5,45 49,45
  pour Bottom: 49.45,-0.5 69.5,-0.5 69.5,15.6 49.45,15.6
  pour Bottom: 25.55,38 25.45,-0.85 32.4,-0.85 32.5,15.95 33,15.95 33,16 57.5,16 57.5,43.95 32.5,44 32.5,61 -1.5,61 -1.5,38
  pour Bottom: -2.45,20 32.7,20.15 32.8,3.5 36.1,0.2 36.1,-1 -2.45,-1.15
  pour Top: -1.3,43 9.5,43 9.5,22 -1.4,22.2 -1.5,22.3 -1.5,37.5 -1.55,37.55
L_LED  (via drill 0.25)
  Top 0.305: L.A 18.25,52.75 18.5,52.5 18.5,50.25 19.35,49.4 20.65,49.4 21.55,48.45 21.55,47.1 24.7,43.95 v24.7,43.3 | v25.5,41 28,38.5 30.4,38.5 30.85,38.05 30.85,37.25 32.7,35.4 32.7,32.5 32.45,32.25 32.45,31.5 v32.6,31.25 | v38.7,29.45 38.8,29.3 v38.8,27.65
  Bottom 0.305: v25.5,41 24.7,41.8 v24.7,43.3 | v32.6,31.25 32.65,30.6 33.8,29.45 v38.7,29.45 | IC1.32 38.83,23.12 38,23.95 38,25.3 38.4,25.7 38.4,26.85 38.8,27.25 v38.8,27.65
N$1  (via drill 0.3)
  Top 0.305: v14.45,52 14.45,52.25 14.95,52.75 PWR.A
  Bottom 0.305: R12.1 13.69,52.76 v14.45,52
N$2
  Bottom 0.305: USB.D+ 18.5,55 17.5,54 R14.1
N$3  (via drill 0.25, 0.3)
  Top 0.305: v16.5,49.7 16.5,46.9 v27.65,35.65 | v28.45,33.95 29.8,32.6 v29.9,32.6
  Bottom 0.305: R13.2 15.5,50.7 v16.5,49.7 | v27.65,35.65 27.65,35.35 27.9,35.1 27.9,34.3 28.25,33.95 v28.45,33.95 | IC1.3 30.5,32.6 v29.9,32.6
N$4  (via drill 0.25, 0.3)
  Top 0.305: v18.5,49.25 18.5,45.7 27.45,36.8 28.1,36.8 v28.15,36.85 | v29.15,34.65 30.45,33.35 v30.6,33.35
  Bottom 0.305: R14.2 17.5,50.25 v18.5,49.25 | v28.15,36.85 28.55,36.4 28.55,35.68 29.15,35.08 v29.15,34.65 | IC1.4 30.88,33.35 v30.6,33.35
N$5
  Bottom 0.305: USB.D- 16.9,58.3 15.95,57.35 15.95,53.21 R13.1
N$6  (via drill 0.3)
  Top 0.813: v12.4,39.95 12.4,33.5 14.2,31.7 14.81,31.7 LED1.CATHODE
  Bottom 0.813: v12.4,39.95 Q1.3
N$7  (via drill 0.3)
  Top 0.813: v52.45,11.5 52.45,10.95 53.7,9.7 53.7,4.15 55.5,2.65 v56.05,2.3
  Bottom 0.305: v56.05,2.3 56,2.3 IC2.P$3
  Bottom 0.813: v52.45,11.5 L1.2
N$8
  Bottom 0.305: IC1.17 41.18,33.58 42.3,34.7 42.5,34.7 43.05,35.25 43.62,35.25 X3.3 44.15,35.16 C21.1
N$9
  Bottom 0.305: IC1.16 41.7,35.3 42.3,35.3 43.6,36.6 43.6,37.53 X3.1 42.92,37.84 C20.1
N$10  (via drill 0.25)
  Top 0.305: L.C 16.75,51.25 16.5,51.5 v16.5,52
  Bottom 0.254: v16.5,52 22.74,52 R11.1
N$11  (via drill 0.3)
  Top 0.305: v95.5,9.7 95.5,10.9 SW2.P2
  Bottom 0.305: R1.1 R2.2 64.59,12.24 67.3,14.95 87.2,14.95 88.35,13.8 88.35,12.15 89.2,11.3 89.2,9.3 89.75,8.75 90.8,8.75 91.75,9.7 v95.5,9.7
N$12  (via drill 0.3)
  Top 0.305: SW2.C 92.9,11.55 92.35,12.1 89.6,12.1 89.45,12.25 88.65,12.25 85.95,14.95 57.9,14.95 55.5,12.55 v55.5,9.8
  Bottom 0.254: IC2.P$7 55.5,8.25
  Bottom 0.305: 55.5,8.25 v55.5,9.8
N$13  (via drill 0.3)
  Top 0.305: v19.5,42 18.5,43 16.55,43 15.55,44 6.5,44 v5.5,43
  Bottom 0.305: R16.2 19.03,40.48 19.5,40.95 v19.5,42 | TP10.TP 4.5,44 v5.5,43
  Bottom 0.813: Q1.2 14.95,40.05 15.4,40.5 17.08,40.5 R16.2
N$14
  Bottom 0.254: IC2.P$10 57.55,7.15
  Bottom 0.305: R5.2 R4.1 C25.1 64.75,3.75 63.75,4.75 59.9,4.75 58.7,5.95 58.7,6.8 58.35,7.15 | 57.55,7.15 58.35,7.15 | TP6.TP 58.5,7.3 58.35,7.15
N$15
  Bottom 0.813: Q2.3 72.55,6.5 | 72.55,6.5 76.3,6.5 76.95,5.85 83.5,5.85 BAT1.GND@1 | TP17.TP 72.5,6.55 72.55,6.5
N$17
  Bottom 0.813: Q3.3 72.85,52 74.85,54 | BAT2.GND@1 83.1,54.55 75.4,54.55 74.88,54.02 74.85,54 | TP18.TP 74.85,54
N$18  (via drill 0.25)
  Top 0.305: v19.5,50.25 TX.C
  Bottom 0.305: v19.5,50.25 R15.1
N$19  (via drill 0.25)
  Top 0.305: v21.9,50.05 RX.C
  Bottom 0.305: v21.9,50.05 R20.1
N$23  (via drill 0.3)
  Top 0.305: v95.75,50 95.75,48.75 SW1.P1
  Bottom 0.305: R7.2 67.04,54.74 70.5,58.2 86.35,58.2 88,56.55 88,49.85 89.15,48.7 94.45,48.7 v95.75,50
  Bottom 0.406: R6.1 R7.2
N$24  (via drill 0.3)
  Top 0.305: v56,53.95 56,56.4 57.8,58.2 86.75,58.2 89.25,55.7 89.25,53.2 93.2,49.25 SW1.C
  Bottom 0.254: IC3.P$7 55.5,53.45
  Bottom 0.305: 55.5,53.45 v56,53.95
N$25  (via drill 0.4)
  Top 0.813: v48.7,56 49.5,56 53.75,51.65 53.75,48.4 v56,46.2
  Bottom 0.254: IC3.P$3 v56,46.2
  Bottom 0.813: v48.7,56 L2.2
N$26
  Bottom 0.305: R10.2 67.91,46.24 67.65,46.5 67.65,47.55 67.45,47.75 66.76,47.75 R9.1 C26.1 64.75,49.25 64,50 59,50 57.9,51.1 | 57.9,51.1 IC3.P$10 | TP7.TP 58.5,51.7 57.9,51.1
PA1L  (via drill 1.2)
  Top 0.305: v58.94,26.35 v58.94,23.81 v58.94,21.27
PA1M  (via drill 1.2)
  Top 0.305: v58.94,28.89 v58.94,31.43
PA1R  (via drill 1.2)
  Top 0.305: v58.94,39.05 v58.94,36.51 v58.94,33.97
PA2L  (via drill 1.2)
  Top 0.305: v61.48,21.27 v61.48,23.81 v61.48,26.35
PA2M  (via drill 1.2)
  Top 0.305: v61.48,28.89 v61.48,31.43
PA2R  (via drill 1.2)
  Top 0.305: v61.48,33.97 v61.48,36.51 v61.48,39.05
PA3L  (via drill 1.2)
  Top 0.305: v64.02,26.35 v64.02,23.81 v64.02,21.27
PA3M  (via drill 1.2)
  Top 0.305: v64.02,28.89 v64.02,31.43
PA3R  (via drill 1.2)
  Top 0.305: v64.02,39.05 v64.02,36.51 v64.02,33.97
PA4L  (via drill 1.2)
  Top 0.305: v66.56,21.27 v66.56,23.81 v66.56,26.35
PA4M  (via drill 1.2)
  Top 0.305: v66.56,28.89 v66.56,31.43
PA4R  (via drill 1.2)
  Top 0.305: v66.56,33.97 v66.56,36.51 v66.56,39.05
PA5L  (via drill 1.2)
  Top 0.305: v69.1,26.35 v69.1,23.81 v69.1,21.27
PA5M  (via drill 1.2)
  Top 0.305: v69.1,28.89 v69.1,31.43
PA5R  (via drill 1.2)
  Top 0.305: v69.1,39.05 v69.1,36.51 v69.1,33.97
PA6L  (via drill 1.2)
  Top 0.305: v71.64,21.27 v71.64,23.81 v71.64,26.35
PA6M  (via drill 1.2)
  Top 0.305: v71.64,28.89 v71.64,31.43
PA6R  (via drill 1.2)
  Top 0.305: v71.64,33.97 v71.64,36.51 v71.64,39.05
PA7L  (via drill 1.2)
  Top 0.305: v74.18,21.27 v74.18,23.81 v74.18,26.35
PA7M  (via drill 1.2)
  Top 0.305: v74.18,28.89 v74.18,31.43
PA7R  (via drill 1.2)
  Top 0.305: v74.18,33.97 v74.18,36.51 v74.18,39.05
PA8L  (via drill 1.2)
  Top 0.305: v76.72,26.35 v76.72,23.81 v76.72,21.27
PA8M  (via drill 1.2)
  Top 0.305: v76.72,28.89 v76.72,31.43
PA8R  (via drill 1.2)
  Top 0.305: v76.72,33.97 v76.72,36.51 v76.72,39.05
PA9L  (via drill 1.2)
  Top 0.305: v79.26,21.27 v79.26,23.81 v79.26,26.35
PA9M  (via drill 1.2)
  Top 0.305: v79.26,28.89 v79.26,31.43
PA9R  (via drill 1.2)
  Top 0.305: v79.26,39.05 v79.26,36.51 v79.26,33.97
PA10L  (via drill 1.2)
  Top 0.305: v81.8,26.35 v81.8,23.81 v81.8,21.27
PA10M  (via drill 1.2)
  Top 0.305: v81.8,28.89 v81.8,31.43
PA10R  (via drill 1.2)
  Top 0.305: v81.8,39.05 v81.8,36.51 v81.8,33.97
PA11L  (via drill 1.2)
  Top 0.305: v84.34,21.27 v84.34,23.81 v84.34,26.35
PA11M  (via drill 1.2)
  Top 0.305: v84.34,28.89 v84.34,31.43
PA11R  (via drill 1.2)
  Top 0.305: v84.34,33.97 v84.34,36.51 v84.34,39.05
PA12L  (via drill 1.2)
  Top 0.305: v86.88,26.35 v86.88,23.81 v86.88,21.27
PA12M  (via drill 1.2)
  Top 0.305: v86.88,28.89 v86.88,31.43
PA12R  (via drill 1.2)
  Top 0.305: v86.88,39.05 v86.88,36.51 v86.88,33.97
PA13L  (via drill 1.2)
  Top 0.305: v89.42,21.27 v89.42,23.81 v89.42,26.35
PA13M  (via drill 1.2)
  Top 0.305: v89.42,28.89 v89.42,31.43
PA13R  (via drill 1.2)
  Top 0.305: v89.42,33.97 v89.42,36.51 v89.42,39.05
PA14L  (via drill 1.2)
  Top 0.305: v91.96,26.35 v91.96,23.81 v91.96,21.27
PA14M  (via drill 1.2)
  Top 0.305: v91.96,28.89 v91.96,31.43
PA14R  (via drill 1.2)
  Top 0.305: v91.96,39.05 v91.96,36.51 v91.96,33.97
PA15L  (via drill 1.2)
  Top 0.305: v94.5,21.27 v94.5,23.81 v94.5,26.35
PA15M  (via drill 1.2)
  Top 0.305: v94.5,28.89 v94.5,31.43
PA15R  (via drill 1.2)
  Top 0.305: v94.5,33.97 v94.5,36.51 v94.5,39.05
PA16L  (via drill 1.2)
  Top 0.305: v97.04,26.35 v97.04,23.81 v97.04,21.27
PA16M  (via drill 1.2)
  Top 0.305: v97.04,28.89 v97.04,31.43
PA16R  (via drill 1.2)
  Top 0.305: v97.04,39.05 v97.04,36.51 v97.04,33.97
RST  (via drill 0.25, 0.3)
  Top 0.305: v28,14.95 28.15,14.95 v30.7,17.5 | v37.85,34.95 38.45,35.45 39.25,35.45 41.8,32.75 48.1,32.75 RESET.P$2 v48.5,31.35 | v33.1,23.15 37.45,23.15 37.75,23.35 52.65,23.35 v52.9,23.6 | v16,7.05 16,6.65 16.8,5.85 17.57,5.85 ISP6.5
  Bottom 0.254: ISP6.5 17.6,5.9 18.8,7.1 23.15,7.1 23.5,7.45 | 54.9,31.25 53.6,31.25
  Bottom 0.305: 23.5,7.45 27.65,11.5 27.65,14.45 v28,14.95 | v30.7,17.5 30.9,17.5 31.45,18.05 31.45,21.6 v33.1,23.15 | v37.85,34.95 37.91,34.9 IC1.13 | v48.5,31.35 53.5,31.35 53.6,31.25 | 54.9,31.25 55.45,30.7 55.45,24.2 54.85,23.6 v52.9,23.6 | TP13.TP 16.5,12.55 16,12.05 v16,7.05
RX_LED  (via drill 0.25, 0.3)
  Top 0.305: v30.6,40.3 30,40.95 29.1,41.85 28.45,41.85 27.4,42.9 27.35,42.9 22.65,47.6 22.65,53.3 v22.5,53.45
  Bottom 0.305: IC1.8 34.04,34.81 33.25,35.6 33.25,37.05 30.6,39.7 v30.6,40.3 | v22.5,53.45 22.3,53.4 21.5,53.4 R20.2
SW1  (via drill 0.25, 0.3)
  Top 0.305: v32.75,20.15 v36.95,20.15 | v27.6,21.15 27.6,21.35 13.05,21.35 9.95,18.25 9.95,15.15 | 9.95,15.15 9.95,14 SW.P$2 | v9.75,15.25 9.8,15.25 9.95,15.15
  Bottom 0.254: 30.95,16.2 31.05,16.15 32.55,16.15 32.8,16.35
  Bottom 0.305: R18.2 9.39,15.24 v9.75,15.25 | v27.6,21.15 27.6,20.85 27.3,20.45 27.3,19.4 30.55,16.2 30.95,16.2 | 32.8,16.35 32.8,17.45 33,17.75 33,19.8 v32.75,20.15 | IC1.33 38.28,22.52 39.1,21.7 39.1,20.85 38.4,20.15 v36.95,20.15
THERMAL  (via drill 0.5)
  other vias: 21,32.7 21.4,31.4 21.4,30 21.4,28.8 21,27.4 19.8,26.9 18.5,26.9 17.2,27.4 16.9,28.7 16.9,30 16.9,31.4 17.3,32.7 18.6,33.1 19.9,33.1 20.7,33.9 22.4,32.3 21.9,33.5 22.5,30.7 22.5,29.4 22.3,27.9 22,26.7 20.8,26.2 19.2,26 17.8,26 15.9,27 14.4,26.9 13.8,30 13.1,31.1 13,29.1 14.4,33.1 15.9,33.1 19.2,34.1 17.9,34.1 16.6,34.1 15.2,34.1 15.1,26 16.5,26
  pour Top: 11.5,34 arc-90 12.5,35 22.5,35 arc-90 23.5,34 23.5,26 arc-90 22.5,25 12.5,25 arc-90 11.5,26
  pour Bottom: 9.4,35 arc-90 11.4,37 22.5,37 arc-90 25,35.1 25,25.1 arc-90 22.5,23 10.5,23 arc-90 9.5,24
TX_LED  (via drill 0.25)
  Top 0.305: v25.8,43.3 25.8,43.65 22.1,47.35 22.1,48.65 20.5,50.35 v20.5,52.75 | v26.2,41.75 28.9,39.05 31.2,39.05 32,39.85 32.65,39.85 33.15,39.35 33.15,38.15 33.7,37.6 34.2,37.6 34.25,37.65 36.95,37.65 37.35,38.05 37.85,38.05 38.55,37.35 40.35,37.35 42.95,34.75 v42.95,34.15
  Bottom 0.305: v26.2,41.75 25.8,42.15 v25.8,43.3 | IC1.22 44,30.95 44.95,31.9 44.95,32.3 44.55,32.7 44.1,33.2 43.15,34.15 v42.95,34.15 | v20.5,52.75 20.5,52.76 R15.2
VAUX1  (via drill 0.3)
  Top 0.305: v60.1,5.65 59.85,5.65 v58,3.8
  Bottom 0.254: 57.5,3.8 57.15,3.8 IC2.P$1
  Bottom 0.305: Q2.1 63.41,5.64 C4.2 v60.11,5.64 v60.1,5.65 | 57.5,3.8 v58,3.8
VAUX2  (via drill 0.3)
  Top 0.305: v59.95,51.05 59.95,49.85 v58,47.9
  Bottom 0.305: Q3.1 C10.2 v59.96,51.04 v59.95,51.05 | IC3.P$1 v58,47.9
VBUS  (via drill 0.3)
  Top 0.406: 16.9,55.5 15.5,54.1 13.95,54.1 13.15,53.3 13.15,49.2 v11.95,48
  Top 0.813: 16.9,55.5 USB.VBUS
  Bottom 0.406: 13.54,48 v11.95,48
  Bottom 0.813: L3.1 13.54,48
VCC  (via drill 0.25, 0.3)
  Top 0.254: ISP6.2 26.3,10.9 v29.95,14.55
  Top 0.305: 7.67,9.92 SW.P$1 10.6,12.88 10.6,18.05 13.15,20.6 22.85,20.6 v25,18.45
  Top 0.406: v28.55,27.95 27.95,28.55 v25.3,28.55 | v33.6,16.5 34.1,16 v34.1,14.75 | v36.95,41 36.95,40.7 37.65,40 39.35,40 v39.55,40.2
  Top 0.813: 5V.2 5V.3 72,42.9 72.1,43 72.2,42.9 5V.4 | LED1.ANODE 14.16,28.61 13.35,27.8 10.9,27.8 10.5,28.2 v10.5,37
  Bottom 0.254: 56.5,47.3 IC3.P$2 | IC2.P$2 56.5,3.15 56.75,2.85 56.75,1.6 | 31.57,14.55 C15.2
  Bottom 0.305: R9.2 C26.2 62.75,46.24 C12.2 | 57,46.8 56.5,47.3 | 25.8,18.7 25.25,18.7 v25,18.45
  Bottom 0.406: R4.2 C25.2 62.75,1.24 C5.2 | IC1.14 40.2,36.06 40.2,37.4 39.85,37.75 39.85,38.75 C27.1 40.21,39.14 39.55,39.8 v39.55,40.2 | 31.98,44.95 31.98,44.72 35.7,40.95 36.9,40.95 v36.95,41 | v28.55,27.95 29.1,27.37 C28.1 28.68,26.81 IC1.44 | 25.8,28.55 v25.3,28.55 | v34.1,14.75 33.6,14.25 33.25,14.25 | IC1.34 34.37,21.18 C18.1 33.6,20.45 v33.6,16.5 33.65,16.35 40.5,16.35 45,20.85 45,26.22 C17.1 44.52,26.7 44.35,26.7 43.41,27.64 IC1.24 | 54.55,0.95 54.6,0.85 54.7,0.75 57.05,0.75 57.1,0.9
  Bottom 0.61: 57,45.05 57,46.8 | TP8.TP 25.75,20 25.8,19.95
  Bottom 0.813: C5.2 C6.2 58.68,1.48 58,0.9 57.1,0.9 56.75,0.9 56.75,1.6 | 57.05,44.95 31.98,44.95 C16.2 25.8,39.78 25.8,38.7 | 57.05,44.95 57.95,44.95 59.48,46.48 C11.2 C12.2 62.5,45.4 64.5,43.4 5V.1 5V.2 | 57.05,44.95 57,45.05 | C15.2 32.98,14.52 33.25,14.25 33.25,3.85 35.8,1.3 47.9,1.3 48.25,0.95 54.55,0.95 | 31.57,14.55 v29.95,14.55 25.8,18.7 25.8,19.95 25.8,28.55 25.8,38.7 | 25.8,38.7 10.55,38.7 | 10.55,38.7 10.5,38.7 C14.2 C13.2 | v10.5,37 10.5,38.65 10.55,38.7
VI1  (via drill 0.3)
  Top 0.305: v54.7,8.5 54.7,8.35 54.5,8.15 54.5,4.8 56.25,3.15 56.85,2.8 56.85,2 56.35,1.5 55.4,1.5 v55.25,1.65
  Bottom 0.254: IC2.P$6 55,8.2 v54.7,8.5
  Bottom 0.305: C3.2 52.59,3.95 IC2.P$5 55,3.15 54.26,2.41 R3.1 54.41,1.9 v55.25,1.65
VI2  (via drill 0.3)
  Top 0.305: v54.55,53 54.55,48.85 56.85,46.55 56.85,45.7 56.45,45.4 55,45.4 v53.35,47.05
  Bottom 0.254: 54.25,47.9 IC3.P$5 | IC3.P$6 55,51.8 v54.55,53
  Bottom 0.305: R8.1 54.26,47.89 54.25,47.9 53.45,47.9 | 53.45,47.9 52.64,47.9 C9.2 | v53.35,47.05 53.35,47.8 53.45,47.9

### Text on the board
Top: Thanks to / / Arduino.cc / for Software / / Adafruit / for Design / / Sparkfun / for Footprints
tNames: USB | D7 | D9~ | D11~ | D12 | D14/MISO | D15/SCK | D16/MOSI | GND | SW1 | Batt | Akku | AREF | A3 | A2 | A1 | A0 | SW2 | Kultpfunzel.ch | macht hell & ist hackable | RX1/D0 | TX1/D1 | SDA/D2 | SCL/~D3 | A6/~D4 | A7/D6 | D7 | Batt | Akku | compatible to / Arduino Leonardo | v1.4
tDocu: (c) 2013, Interactive Matter / This work is licensed under a Creative Commons Attribution 3.0 Unported License. / / based on works by arduino.cc, adafruit and sparkfun